# Altium schematic sheet Power.SchDoc
size A; SheetNumber: 6; SheetTotal: 8; SPICEModelCacheOOHVENGF: <root> / <DocumentId>OOHVENGF</DocumentId> / <CacheFrame Number="0"> / <Model Name="led0" Kind="MDL"> / <Text>*Typ INFRARED GaAs LED: Vf=1.2V Vr=5V If=40mA trr=3uS / *LED Pinout: 1=A, 2=K / .MODEL LED0 D (IS=93.5P RS=84M N=2.63 BV=5 IBV=10U / + CJO=2.97P VJ=.75 M=.333 TT=4.32U)</Text> / </Model> / <Model Name="diode" Kind="MDL"> / <Text>*Default Diode / *Diode Pinout: A,K / .MODEL DIODE D()</Text> / </Model> / </CacheFrame> / </root>
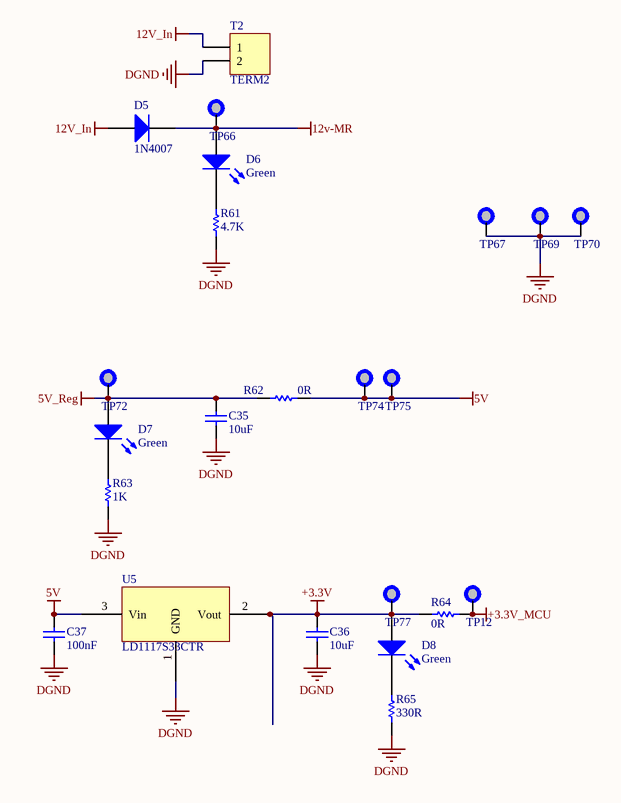
[diagram p0: Power.SchDoc]

## Parts
C35  value 10uF  [1206C]  (hidden comment: 10uF/50V)
C36  value 10uF  [1206C]  (hidden comment: 10uF/50V)
C37  100nF  [0603c]
D5  1N4007  [SMC]
D6  Green  [0805LED]
D7  Green  [0805LED]
D8  Green  [0805LED]
R61  4.7K  [0805]
R62  0R  [1206]
R63  1K  [0805]
R64  0R  [1206]
R65  330R  [0805]
T2  TERM2  [term2]
TP12  TestPoint  [TP]  (value not drawn)
TP66  TestPoint  [TP]  (value not drawn)
TP67  TestPoint  [TP]  (value not drawn)
TP69  TestPoint  [TP]  (value not drawn)
TP70  TestPoint  [TP]  (value not drawn)
TP72  TestPoint  [TP]  (value not drawn)
TP74  TestPoint  [TP]  (value not drawn)
TP75  TestPoint  [TP]  (value not drawn)
TP77  TestPoint  [TP]  (value not drawn)
U5  LD1117S33CTR  [sot223]

## Nets
5V: C37.1 R62.2 TP74.1 TP75.1 U5.3(Vin)
5V_Reg: C35.2 D7.1(A) R62.1 TP72.1
12v-MR: D5.2(K) D6.1(A) TP66.1
12V_In: D5.1(A) T2.1
+3.3V: C36.2 D8.1(A) R64.1 TP77.1 U5.2(Vout) U5.4(Vout)
+3.3V_MCU: R64.2 TP12.1
DGND: C35.1 C36.1 C37.2 R61.1 R63.1 R65.1 T2.2 TP67.1 TP69.1 TP70.1 U5.1(GND)
NetD6_2: D6.2(K) R61.2
NetD7_2: D7.2(K) R63.2
NetD8_2: D8.2(K) R65.2

## Library data of the parts
C35-C37 = Cap: LOW ESR; Published: 8-Jun-2000; LatestRevisionDate: 17-Jul-2002; LatestRevisionNote: Re-released for DXP Platform.; PackageReference: RAD-0.3; Publisher: Altium Limited; PackageDescription: Radial Cap, Thru-Hole; 2 Leads; 0.3 in Pin Spacing
  C37: Value: 100nF
D5 = Diode: Published: 8-Jun-2000; LatestRevisionDate: 17-Jul-2002; LatestRevisionNote: Re-released for DXP Platform.; PackageVersion: Sep-1996; PackageReference: SMC; Publisher: Altium Limited; PackageDescription: DO-214-AB/SMC; 2 C-Bend Leads; Body 7.9 x 5.9 mm, inc. leads (LxW); Code_JEDEC: DO-214-AB; Value: 1N4007
D6-D8 = LED0: Published: 8-Jun-2000; LatestRevisionDate: 08-Jul-2005; LatestRevisionNote: Mech Layer 1 removed.; PackageReference: LED-0; Publisher: Altium Limited; PackageDescription: LED; 2 Leads
R61-R65 = Res1: Resistor; Published: 8-Jun-2000; LatestRevisionDate: 17-Jul-2002; LatestRevisionNote: Re-released for DXP Platform.; PackageReference: AXIAL-0.3; Publisher: Altium Limited; PackageDescription: Axial Device, Thru-Hole; 2 Leads; 0.3 in Pin Spacing
  R61: Value: 4.7K
  R62 R64: Value: 0R
  R63: Value: 1K
  R65: Value: 330R
T2 = Header 2: Header, 2-Pin; LatestRevisionDate: 17-Jul-2002; LatestRevisionNote: Re-released for DXP Platform.; Publisher: Altium Limited
U5 = AMS1117